# EAGLE design minion_v0.3_rev1 (EAGLE 9.6.2)

## Sheet 1 of 6
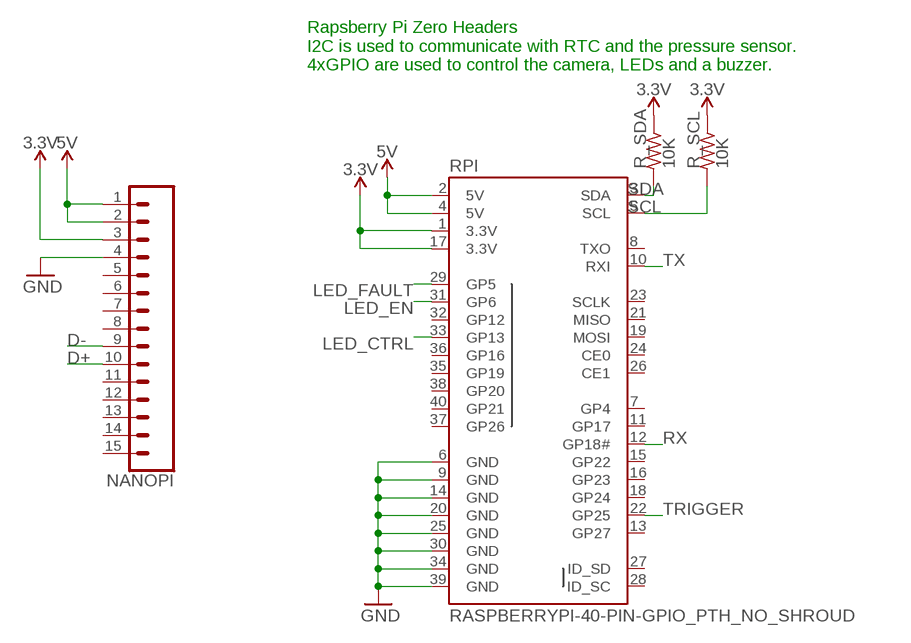
[diagram p0: schematic, sheet 1]

### Parts
NANOPI  CONN_15  [1X15]
R_SCL  10K  RC0603JR-070RL  [RES_0603]
R_SDA  10K  RC0603JR-070RL  [RES_0603]
RPI  RASPBERRYPI-40-PIN-GPIO_PTH_NO_SHROUD  [2X20]

### Nets
3.3V: NANOPI.3 R_SCL.1 R_SDA.1 RPI.1(3.3V) RPI.17(3.3V) ; also sheet 4
5V: NANOPI.1 NANOPI.2 RPI.2(5V) RPI.4(5V) ; also sheet 2,3,5,6
D+: NANOPI.10 ; also sheet 5
D-: NANOPI.9 ; also sheet 5
GND: NANOPI.4 RPI.6(GND) RPI.9(GND) RPI.14(GND) RPI.20(GND) RPI.25(GND) RPI.30(GND) RPI.34(GND) RPI.39(GND) ; also sheet 2,3,4,5,6
LED_CTRL: RPI.33(GP13) ; also sheet 3
LED_EN: RPI.31(GP6) ; also sheet 3
LED_FAULT: RPI.29(GP5) ; also sheet 3
RX: RPI.12(GP18#) ; also sheet 6
SCL: R_SCL.2 RPI.5(SCL) ; also sheet 4
SDA: R_SDA.2 RPI.3(SDA) ; also sheet 4
TRIGGER: RPI.22(GP25) ; also sheet 5
TX: RPI.10(RXI) ; also sheet 6
Unconnected: NANOPI.5 NANOPI.6 NANOPI.7 NANOPI.8 NANOPI.11 NANOPI.12 NANOPI.13 NANOPI.14 NANOPI.15 RPI.7(GP4) RPI.8(TXO) RPI.11(GP17) RPI.13(GP27) RPI.15(GP22) RPI.16(GP23) RPI.18(GP24) RPI.19(MOSI) RPI.21(MISO) RPI.23(SCLK) RPI.24(CE0) RPI.26(CE1) RPI.27(ID_SD) RPI.28(ID_SC) RPI.32(GP12) RPI.35(GP19) RPI.36(GP16) RPI.37(GP26) RPI.38(GP20) RPI.40(GP21)

### Notes on the sheet
- Rapsberry Pi Zero Headers
  I2C is used to communicate with RTC and the pressure sensor.
  4xGPIO are used to control the camera, LEDs and a buzzer.

## Sheet 2 of 6: Power to System
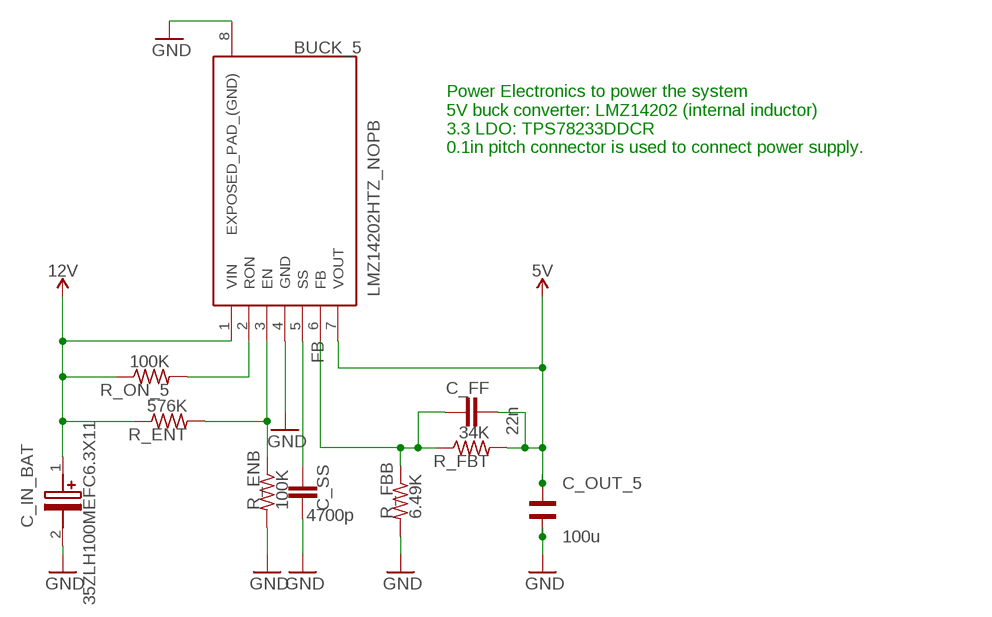
[diagram p1: schematic, sheet 2]

### Parts
BUCK_5  LMZ14202HTZ_NOPB  [NDW0007A]
C_FF  22n  C0603C100C5GACTU  [CAP_0603]
C_IN_BAT  35ZLH100MEFC6.3X11  [CAPPRD250W50D680H1250]
C_OUT_5  100u  WCAP-CSGP_1206_885012008010  [WCAP-CSGP_1206]
C_SS  4700p  C0603C100C5GACTU  [CAP_0603]
R_ENB  100K  RC0603JR-070RL  [RES_0603]
R_ENT  576K  RC0603JR-070RL  [RES_0603]
R_FBB  6.49K  RC0603JR-070RL  [RES_0603]
R_FBT  34K  RC0603JR-070RL  [RES_0603]
R_ON_5  100K  RC0603JR-070RL  [RES_0603]

### Nets
5V: BUCK_5.7(VOUT) C_FF.2 C_OUT_5.2 R_FBT.2 ; also sheet 1,3,5,6
12V: BUCK_5.1(VIN) C_IN_BAT.1(+) R_ENT.1 R_ON_5.1 ; also sheet 6
FB: BUCK_5.6(FB) C_FF.1 R_FBB.1 R_FBT.1
GND: BUCK_5.4(GND) BUCK_5.8(EXPOSED_PAD_(GND)) C_IN_BAT.2(-) C_OUT_5.1 C_SS.2 R_ENB.2 R_FBB.2 ; also sheet 1,3,4,5,6
N$7: BUCK_5.2(RON) R_ON_5.2
N$9: BUCK_5.3(EN) R_ENB.1 R_ENT.2
N$10: BUCK_5.5(SS) C_SS.1

### Notes on the sheet
- Power Electronics to power the system
  5V buck converter: LMZ14202 (internal inductor)
  3.3 LDO: TPS78233DDCR
  0.1in pitch connector is used to connect power supply.

## Sheet 3 of 6: LED Driver
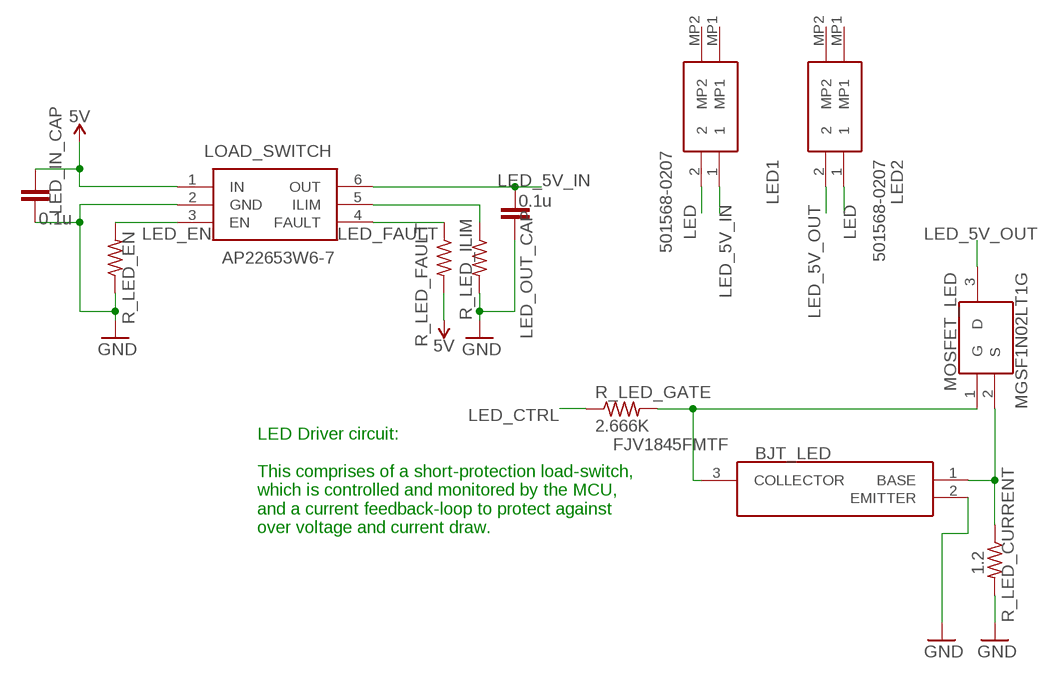
[diagram p2: schematic, sheet 3]

### Parts
BJT_LED  FJV1845FMTF  [SOT95P240X114-3N]
LED1  501568-0207  [5015680207]
LED2  501568-0207  [5015680207]
LED_IN_CAP  0.1u  C0603C100C5GACTU  [CAP_0603]
LED_OUT_CAP  0.1u  C0603C100C5GACTU  [CAP_0603]
LOAD_SWITCH  AP22653W6-7  BCR430UW6-7  [SOT95P285X140-6N]
MOSFET_LED  MGSF1N02LT1G  [SOT96P237X111-3N]
R_LED_CURRENT  1.2  RC0603JR-070RL  [RES_0603]
R_LED_EN  10K  RC0603JR-070RL  [RES_0603]
R_LED_FAULT  10K  RC0603JR-070RL  [RES_0603]
R_LED_GATE  2.666K  RC0603JR-070RL  [RES_0603]
R_LED_ILIM  10K  RC0603JR-070RL  [RES_0603]

### Nets
5V: LED_IN_CAP.1 LOAD_SWITCH.1(IN) R_LED_FAULT.2 ; also sheet 1,2,5,6
GND: BJT_LED.2(EMITTER) LED_IN_CAP.2 LED_OUT_CAP.2 LOAD_SWITCH.2(GND) R_LED_CURRENT.2 R_LED_EN.1 R_LED_ILIM.2 ; also sheet 1,2,4,5,6
LED: LED1.2 LED2.1
LED_5V_IN: LED1.1 LED_OUT_CAP.1 LOAD_SWITCH.6(OUT)
LED_5V_OUT: LED2.2 MOSFET_LED.3(D)
LED_CTRL: R_LED_GATE.1 ; also sheet 1
LED_EN: LOAD_SWITCH.3(EN) R_LED_EN.2 ; also sheet 1
LED_FAULT: LOAD_SWITCH.4(FAULT) R_LED_FAULT.1 ; also sheet 1
N$2: BJT_LED.3(COLLECTOR) MOSFET_LED.1(G) R_LED_GATE.2
N$3: BJT_LED.1(BASE) MOSFET_LED.2(S) R_LED_CURRENT.1
N$5: LOAD_SWITCH.5(ILIM) R_LED_ILIM.1
Unconnected: LED1.MP1 LED1.MP2 LED2.MP1 LED2.MP2

### Notes on the sheet
- LED Driver circuit:
  
  This comprises of a short-protection load-switch, 
  which is controlled and monitored by the MCU, 
  and a current feedback-loop to protect against 
  over voltage and current draw.

## Sheet 4 of 6: Peripherals
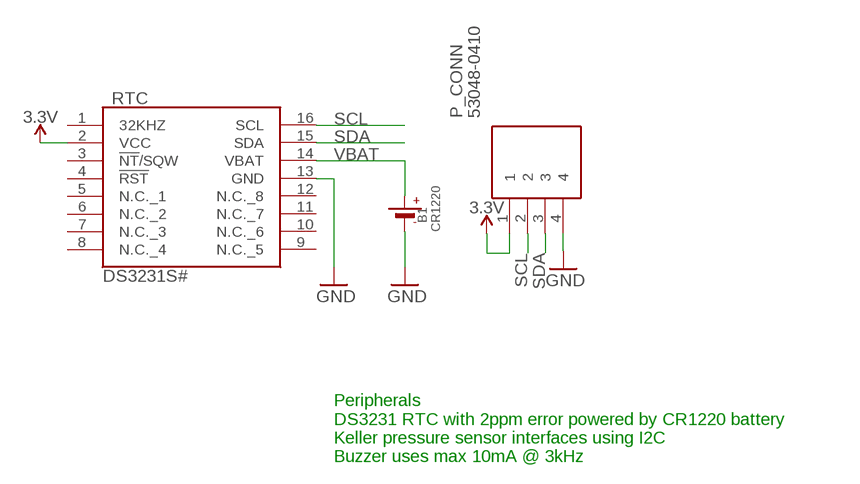
[diagram p3: schematic, sheet 4]

### Parts
B1  CR1220  BATTERYCR1220_SMT  [CR1220]
P_CONN  53048-0410  [SHDR4W35P0X125_1X4_675X550X370]
RTC  DS3231S#  [SOIC127P1032X265-16N]

### Nets
3.3V: P_CONN.1 RTC.2(VCC) ; also sheet 1
GND: B1.- P_CONN.4 RTC.13(GND) ; also sheet 1,2,3,5,6
SCL: P_CONN.2 RTC.16(SCL) ; also sheet 1
SDA: P_CONN.3 RTC.15(SDA) ; also sheet 1
VBAT: B1.+$1(+) RTC.14(VBAT)
Unconnected: RTC.1(32KHZ) RTC.3(!NT!/SQW) RTC.4(!RST) RTC.5(N.C._1) RTC.6(N.C._2) RTC.7(N.C._3) RTC.8(N.C._4) RTC.9(N.C._5) RTC.10(N.C._6) RTC.11(N.C._7) RTC.12(N.C._8)

### Notes on the sheet
- Peripherals
  DS3231 RTC with 2ppm error powered by CR1220 battery
  Keller pressure sensor interfaces using I2C
  Buzzer uses max 10mA @ 3kHz

## Sheet 5 of 6: Camera Trigger
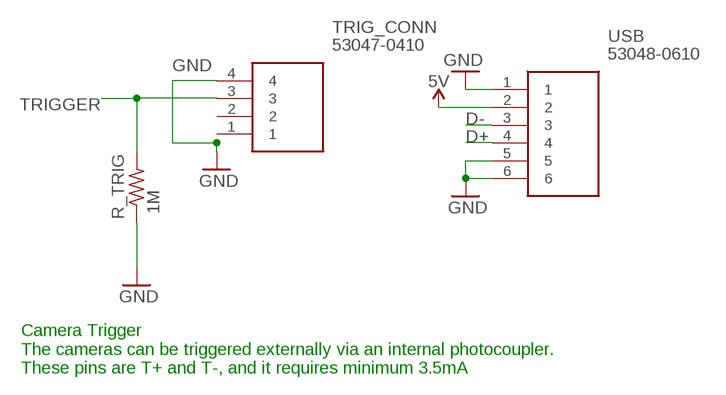
[diagram p4: schematic, sheet 5]

### Parts
R_TRIG  1M  RC0603JR-070RL  [RES_0603]
TRIG_CONN  53047-0410  [53047-0410]
USB  53048-0610  [SHDR6W35P0X125_1X6_925X550X370]

### Nets
5V: USB.2 ; also sheet 1,2,3,6
D+: USB.4 ; also sheet 1
D-: USB.3 ; also sheet 1
GND: R_TRIG.1 TRIG_CONN.1 TRIG_CONN.4 USB.1 USB.5 USB.6 ; also sheet 1,2,3,4,6
TRIGGER: R_TRIG.2 TRIG_CONN.3 ; also sheet 1
Unconnected: TRIG_CONN.2

### Notes on the sheet
- Camera Trigger
  The cameras can be triggered externally via an internal photocoupler. 
  These pins are T+ and T-, and it requires minimum 3.5mA

## Sheet 6 of 6: POWER SRC
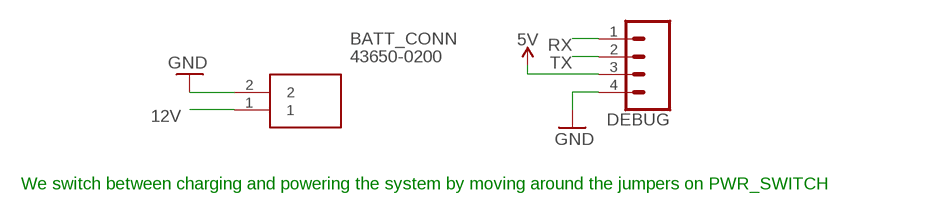
[diagram p5: schematic, sheet 6]

### Parts
BATT_CONN  43650-0200  [43650-0200]
DEBUG  CONN_04  [1X04]

### Nets
5V: DEBUG.3 ; also sheet 1,2,3,5
12V: BATT_CONN.1 ; also sheet 2
GND: BATT_CONN.2 DEBUG.4 ; also sheet 1,2,3,4,5
RX: DEBUG.1 ; also sheet 1
TX: DEBUG.2 ; also sheet 1

### Notes on the sheet
- We switch between charging and powering the system by moving around the jumpers on PWR_SWITCH

## Library data of the parts
B1 = microbuilder:BATTERY: CR1220 SMT - Digikey: 3001K-ND CD2032 BAT-HLD-001 - Digikey: BAT-HLD-001-ND
BATT_CONN = SamacSys_Parts:43650-0200: Header 3.00mm, WTB single row, RA, 2w Molex MICRO-FIT 3.0 Series, Series Number 43650, 3mm Pitch 2 Way 1 Row Shrouded Right Angle PCB Header, Through Hole Source: Datasheet <http://www.molex.com/pdm_docs/sd/436500200_sd.pdf>; DESCRIPTION: Header 3.00mm, WTB single row, RA, 2w Molex MICRO-FIT 3.0 Series, Series Number 43650, 3mm Pitch 2 Way 1 Row Shrouded Right Angle PCB Header, Through Hole; HEIGHT: mm; MANUFACTURER_NAME: Molex; MANUFACTURER_PART_NUMBER: 43650-0200; MOUSER_PART_NUMBER: 538-43650-0200; MOUSER_PRICE-STOCK: https://www.mouser.co.uk/ProductDetail/Molex/43650-0200?qs=HlEFOAM0q6XGaAJJj3Pssw%3D%3D
BJT_LED = SamacSys_Parts:FJV1845FMTF: Bipolar Transistors - BJT NPN Epitaxial Transistor Source: Datasheet <https://componentsearchengine.com/Datasheets/1/FJV1845FMTF.pdf>; DESCRIPTION: Bipolar Transistors - BJT NPN Epitaxial Transistor; HEIGHT: 1.14mm; MANUFACTURER_NAME: ON Semiconductor; MANUFACTURER_PART_NUMBER: FJV1845FMTF; MOUSER_PART_NUMBER: 512-FJV1845FMTF; MOUSER_PRICE-STOCK: https://www.mouser.com/Search/Refine.aspx?Keyword=512-FJV1845FMTF
BUCK_5 = SamacSys_Parts:LMZ14202HTZ_NOPB: SIMPLE SWITCHER® 6V to 42V, 2A High Output Voltage Power Module Source: Datasheet <http://www.ti.com/lit/ds/symlink/lmz14202h.pdf>; DESCRIPTION: SIMPLE SWITCHER&#174; 6V to 42V, 2A High Output Voltage Power Module; HEIGHT: mm; MANUFACTURER_NAME: Texas Instruments; MANUFACTURER_PART_NUMBER: LMZ14202HTZ/NOPB; MOUSER_PART_NUMBER: 926-LMZ14202HTZ/NOPB; MOUSER_PRICE-STOCK: https://www.mouser.com/Search/Refine.aspx?Keyword=926-LMZ14202HTZ%2FNOPB
C_FF C_SS LED_IN_CAP LED_OUT_CAP = Resistor_Capacitor:C0603C100C5GACTU: CAP CER 10PF 50V C0G/NP0 0603 Manufacturer's datasheet <https://content.kemet.com/datasheets/KEM_C1003_C0G_SMD.pdf>; CREATED_BY: PCBLayout.com; DIGIKEY_PART_NUMBER: 399-7814-2-ND; MANUFACTURER: KEMET; MPN: C0603C100C5GACTU; PACKAGE: SMD 0603
C_IN_BAT = SamacSys_Parts:35ZLH100MEFC6.3X11: RUBYCON - 35ZLH100MEFC6.3X11 - CAP, ALU ELEC, 100UF, 35V, RAD Source: Datasheet <https://componentsearchengine.com/Datasheets/1/35ZLH100MEFC6.3X11.pdf>; DESCRIPTION: RUBYCON - 35ZLH100MEFC6.3X11 - CAP, ALU ELEC, 100UF, 35V, RAD; HEIGHT: 12.5mm; MANUFACTURER_NAME: Rubycon; MANUFACTURER_PART_NUMBER: 35ZLH100MEFC6.3X11; MOUSER_PART_NUMBER: 232-35ZLH100MEFC63X1; MOUSER_PRICE-STOCK: https://www.mouser.com/Search/Refine.aspx?Keyword=232-35ZLH100MEFC63X1
C_OUT_5 = Wurth_Elektronik_Passive_Capacitors_rev18b:WCAP-CSGP_1206: WCAP-CSGP Ceramic Capacitors Characteristics Multilayer Ceramic Chip Capacitor Recommended soldering:Reflow, for 0603 and 0805 wave soldering is also allowed Operating temperature:-55 °C to +125 °C; Ceramic characteristics: Class I - NPO ; Class II -X7R, X5R High performance ceramic High capacitance stability Minimal aging Termination:Cu/Ni/Sn <http://katalog.we-online.de/media/images/eisos/WCAP-CSGP_pf2.jpg> Details see: http://katalog.we-online.de/en/pbs/WCAP-CSGP-1206? Created: 2015-01-28 2015 (C) Wurth Elektronik
DEBUG = SparkFun-Connectors:CONN_04: Multi connection point. Often used as Generic Header-pin footprint for 0.1 inch spaced/style header connections On any of the 0.1 inch spaced packages, you can populate with these: Break Away Headers - Straight <https://www.sparkfun.com/products/116> (PRT-00116) Break Away Male Headers - Right Angle <https://www.sparkfun.com/products/553> (PRT-00553) Female Headers <https://www.sparkfun.com/products/115> (PRT-00115) Break Away Headers - Machine Pin <https://www.sparkfun.com/products/117> (PRT-00117) Break Away Female Headers - Swiss Machine Pin <https://www.sparkfun.com/products/743> (PRT-00743) For SCREWTERMINALS and SPRING TERMINALS visit here: Screw Terimnals on SparkFun.com <https://www.sparkfun.com/search/results?term=Screw+Terminals> (5mm/3.5mm/2.54mm spacing) This device is also useful as a general connection point to wire up your design to another part of your project. Our various solder wires solder well into these plated through hole pads. Hook-Up Wire - Assortment (Stranded, 22 AWG) <https://www.sparkfun.com/products/11375> (PRT-11375) Hook-Up Wire - Assortment (Solid Core, 22 AWG) <https://www.sparkfun.com/products/11367> (PRT-11367) View the entire wire category on our website here <https://www.sparkfun.com/categories/141> Special notes: Molex polarized connector foot print use with SKU : PRT-08231 with associated crimp pins and housings. 1MM SMD Version SKU: PRT-10208; PROD_ID: CONN-09696
LED1 LED2 = SamacSys_Parts:501568-0207: Molex PICO-CLASP Series, Series Number 501568, 1mm Pitch 2 Way 2 Row Right Angle PCB Header, Solder Termination, 1A Source: Datasheet <https://www.molex.com/pdm_docs/sd/5015680207_sd.pdf>; DESCRIPTION: Molex PICO-CLASP Series, Series Number 501568, 1mm Pitch 2 Way 2 Row Right Angle PCB Header, Solder Termination, 1A; HEIGHT: 3.4mm; MANUFACTURER_NAME: Molex; MANUFACTURER_PART_NUMBER: 501568-0207; MOUSER_PART_NUMBER: 538-501568-0207; MOUSER_PRICE-STOCK: https://www.mouser.co.uk/ProductDetail/Molex/501568-0207?qs=uEWtSLL707WbFjnit2JOEg%3D%3D
LOAD_SWITCH = SamacSys_Parts:BCR430UW6-7: TRANSISTOR LED DRIVER SOT26 Source: Datasheet <https://www.diodes.com/assets/Datasheets/BCR430UW6.pdf>; DESCRIPTION: Load Switch; HEIGHT: 1.4mm; MANUFACTURER_NAME: Diodes Inc.; MANUFACTURER_PART_NUMBER: AP22653; MOUSER_PART_NUMBER: 621-AP22653W6-7; MOUSER_PRICE-STOCK: https://www.mouser.com/ProductDetail/Diodes-Incorporated/AP22653W6-7?qs=rkhjVJ6%2F3ELFrpB7eThLLg%3D%3D
MOSFET_LED = SamacSys_Parts:MGSF1N02LT1G: Source: Datasheet <https://componentsearchengine.com/Datasheets/1/MGSF1N02LT1G.pdf>; HEIGHT: 1.11mm; MANUFACTURER_NAME: ON Semiconductor; MANUFACTURER_PART_NUMBER: MGSF1N02LT1G; MOUSER_PART_NUMBER: 863-MGSF1N02LT1G; MOUSER_PRICE-STOCK: https://www.mouser.com/Search/Refine.aspx?Keyword=863-MGSF1N02LT1G
NANOPI = SparkFun-Connectors:CONN_15: Multi connection point. Often used as Generic Header-pin footprint for 0.1 inch spaced/style header connections On any of the 0.1 inch spaced packages, you can populate with these: Break Away Headers - Straight <https://www.sparkfun.com/products/116> (PRT-00116) Break Away Male Headers - Right Angle <https://www.sparkfun.com/products/553> (PRT-00553) Female Headers <https://www.sparkfun.com/products/115> (PRT-00115) Break Away Headers - Machine Pin <https://www.sparkfun.com/products/117> (PRT-00117) Break Away Female Headers - Swiss Machine Pin <https://www.sparkfun.com/products/743> (PRT-00743) For SCREWTERMINALS and SPRING TERMINALS visit here: Screw Terimnals on SparkFun.com <https://www.sparkfun.com/search/results?term=Screw+Terminals> (5mm/3.5mm/2.54mm spacing) This device is also useful as a general connection point to wire up your design to another part of your project. Our various solder wires solder well into these plated through hole pads. Hook-Up Wire - Assortment (Stranded, 22 AWG) <https://www.sparkfun.com/products/11375> (PRT-11375) Hook-Up Wire - Assortment (Solid Core, 22 AWG) <https://www.sparkfun.com/products/11367> (PRT-11367) View the entire wire category on our website here <https://www.sparkfun.com/categories/141> Special notes: Molex polarized connector foot print use with SKU : PRT-08231 with associated crimp pins and housings. 1MM SMD Version SKU: PRT-10208 NOTES ON THE VARIANTS LOCK and LOCK_LONGPADS... This footprint was designed to help hold the alignment of a through-hole component (i.e. 6-pin header) while soldering it into place. You may notice that each hole has been shifted either up or down by 0.005 of an inch from it's more standard position (which is a perfectly straight line). This slight alteration caused the pins (the squares in the middle) to touch the edges of the holes. Because they are alternating, it causes a "brace" to hold the component in place. 0.005 has proven to be the perfect amount of "off-center" position when using our standard breakaway headers. Although looks a little odd when you look at the bare footprint, once you have a header in there, the alteration is very hard to notice. Also,if you push a header all the way into place, it is covered up entirely on the bottom side.
P_CONN = SamacSys_Parts:53048-0410: 4 way through board PCB 90deg header Molex PICOBLADE Series, Series Number 53048, 1.25mm Pitch 4 Way 1 Row Right Angle PCB Header, Solder Termination, 1A Source: Datasheet <https://componentsearchengine.com/Datasheets/1/53048-0410.pdf>; DESCRIPTION: 4 way through board PCB 90deg header Molex PICOBLADE Series, Series Number 53048, 1.25mm Pitch 4 Way 1 Row Right Angle PCB Header, Solder Termination, 1A; HEIGHT: 3.7mm; MANUFACTURER_NAME: Molex; MANUFACTURER_PART_NUMBER: 53048-0410; MOUSER_PART_NUMBER: 538-53048-0410; MOUSER_PRICE-STOCK: https://www.mouser.com/Search/Refine.aspx?Keyword=538-53048-0410
R_ENB R_ENT R_FBB R_FBT R_LED_CURRENT R_LED_EN R_LED_FAULT R_LED_GATE R_LED_ILIM R_ON_5 R_SCL R_SDA R_TRIG = Resistor_Capacitor:RC0603JR-070RL: RES SMD 0 OHM JUMPER 1/10W 0603 Manufacturer's datasheet <http://www.yageo.com/documents/recent/PYu-RC_Group_51_RoHS_L_10.pdf>; CREATED_BY: PCBLayout.com; DIGIKEY_PART_NUMBER: 311-0.0GRTR-ND; MANUFACTURER: Yageo; MPN: RC0603JR-070RL; PACKAGE: SMD 0603
RPI = SparkFun-Connectors:RASPBERRYPI-40-PIN-GPIO: Raspberry Pi GPIO Header 2x20 pin connector, as found on B, B+, A+ models. Both shrouded PTH and SMT versions available. SparkFun Products: GPIO Shrouded Header <https://www.sparkfun.com/products/13054>- PTH SparkFun Pi Wedge (Preassembled) <https://www.sparkfun.com/products/13717>
RTC = SamacSys_Parts:DS3231S#: Real Time Clock Serial Maxim DS3231S#, Real Time Clock Serial-I2C, 16-Pin SOIC Source: Datasheet <https://componentsearchengine.com/Datasheets/1/DS3231S#.pdf>; DESCRIPTION: Real Time Clock Serial Maxim DS3231S#, Real Time Clock Serial-I2C, 16-Pin SOIC; HEIGHT: 2.65mm; MANUFACTURER_NAME: Maxim Integrated; MANUFACTURER_PART_NUMBER: DS3231S#; MOUSER_PART_NUMBER: 700-DS3231S#; MOUSER_PRICE-STOCK: https://www.mouser.com/Search/Refine.aspx?Keyword=700-DS3231S%23
TRIG_CONN = SamacSys_Parts:53047-0410: 4 way through board PCB straight header Molex PICOBLADE Series, Series Number 53047, 1.25mm Pitch 4 Way 1 Row Straight PCB Header, Solder Termination, 1A Source: Datasheet; DESCRIPTION: 4 way through board PCB straight header Molex PICOBLADE Series, Series Number 53047, 1.25mm Pitch 4 Way 1 Row Straight PCB Header, Solder Termination, 1A; HEIGHT: mm; MANUFACTURER_NAME: Molex; MANUFACTURER_PART_NUMBER: 53047-0410; MOUSER_PART_NUMBER: 538-53047-0410; MOUSER_PRICE-STOCK: https://www.mouser.co.uk/ProductDetail/Molex/53047-0410?qs=DcEdecHHM4i8IPBxVAuJtg%3D%3D
USB = SamacSys_Parts:53048-0610: 6way r/a through board PCB header,125Vac Molex PICOBLADE Series, Series Number 53048, 1.25mm Pitch 6 Way 1 Row Right Angle PCB Header, Solder Termination, 1A Source: Datasheet <https://www.molex.com/pdm_docs/sd/530481010_sd.pdf>; DESCRIPTION: 6way r/a through board PCB header,125Vac Molex PICOBLADE Series, Series Number 53048, 1.25mm Pitch 6 Way 1 Row Right Angle PCB Header, Solder Termination, 1A; HEIGHT: 3.7mm; MANUFACTURER_NAME: Molex; MANUFACTURER_PART_NUMBER: 53048-0610; MOUSER_PART_NUMBER: 538-53048-0610; MOUSER_PRICE-STOCK: https://www.mouser.co.uk/ProductDetail/Molex/53048-0610?qs=4XSMV6Twtb0hBXTOEHM3BQ%3D%3D

## Board
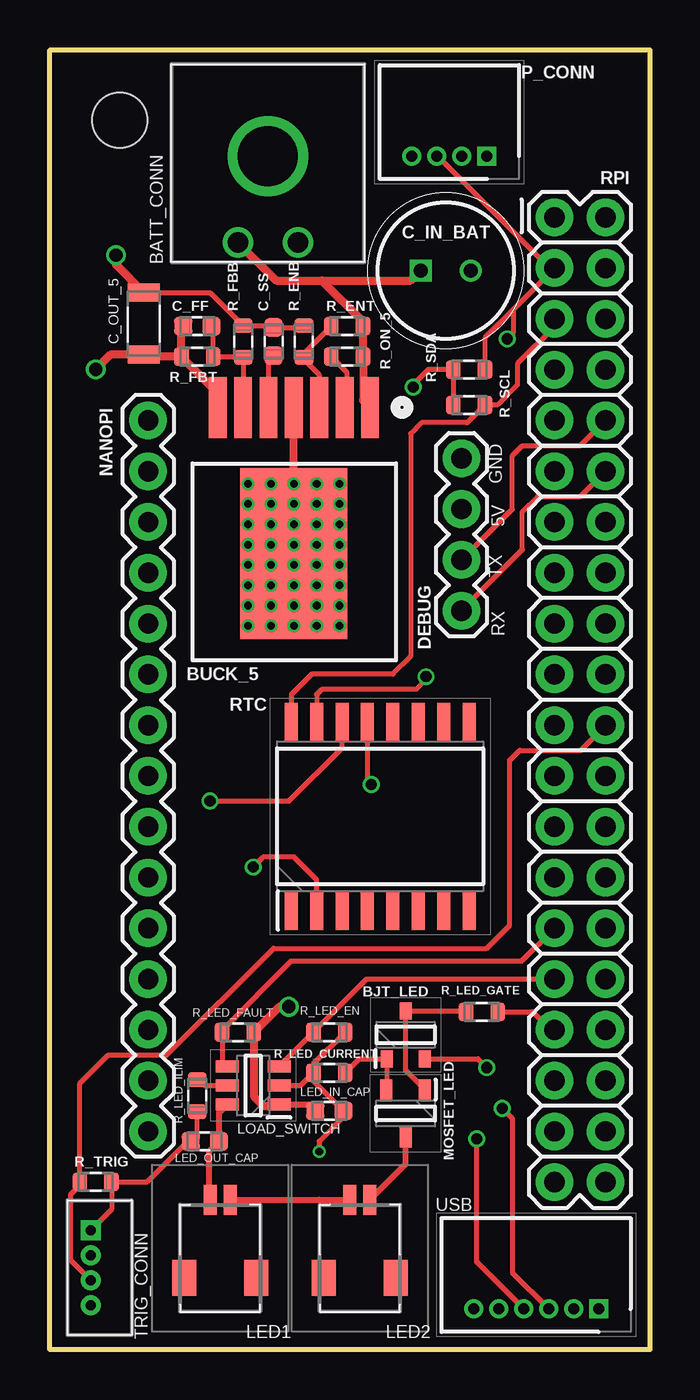
[diagram p6: board, top side]
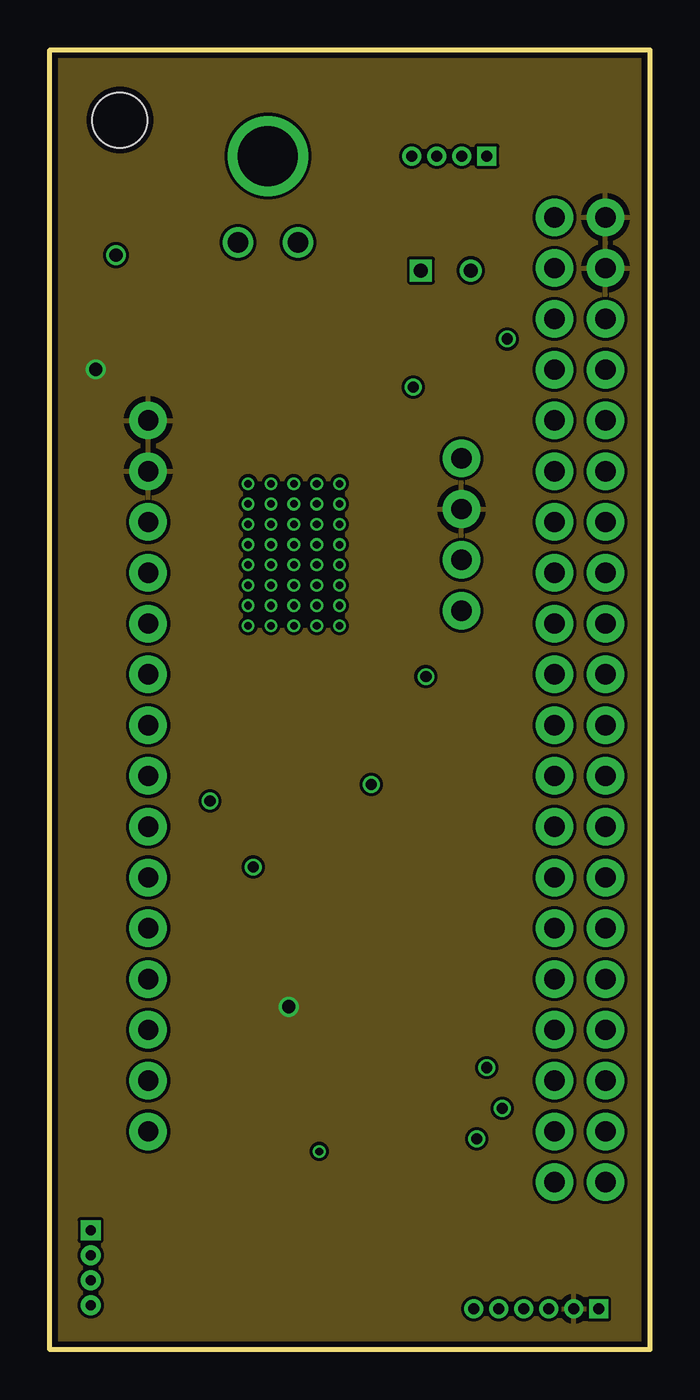
[diagram p7: board, inner layer 5V]
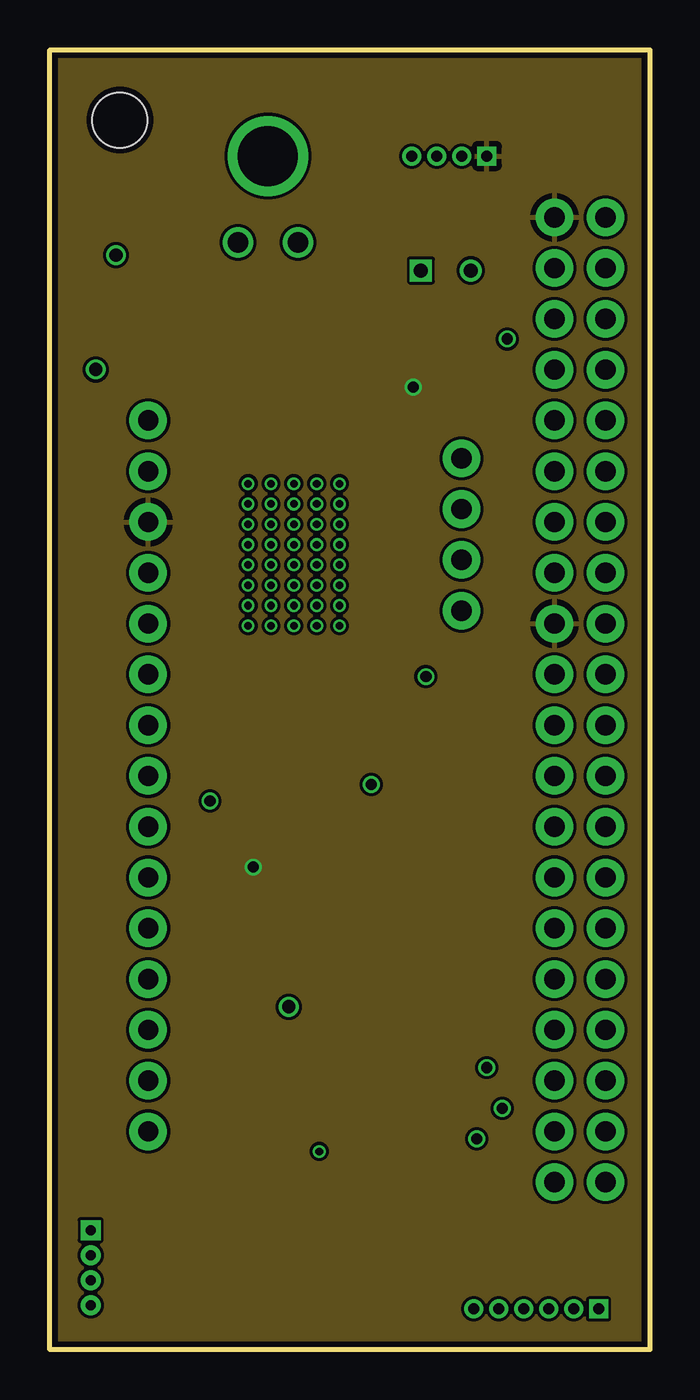
[diagram p8: board, inner layer 3V]
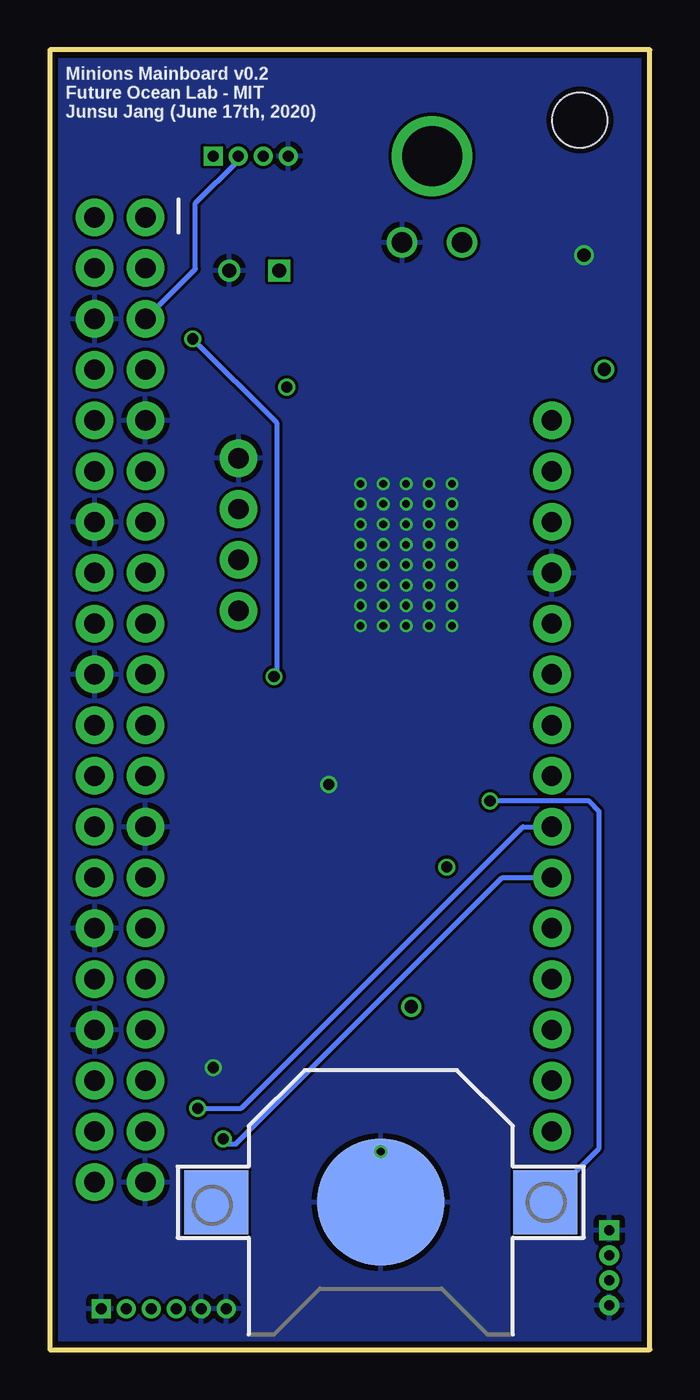
[diagram p9: board, bottom side, seen from below]

Size 30 x 65 mm. Coordinates in mm from the lower left corner, seen from the top.
Outline: 0,0 0,65 30,65 30,0 0,0
Copper layers (1+2*15+16): Top 0.0356mm / dielectric 0.2489mm / 5V 0.0356mm / dielectric 39mil / 3V 0.0356mm / dielectric 0.2489mm / Bottom 0.0356mm
Design rules "advanced_circuits_4layer *": minimum track width 6mil, minimum drill 15mil, track to track 6mil, track to pad 6mil, pad to pad 6mil, via to via 6mil, smd to smd 6mil, copper to edge 11mil, drill to drill 6mil, minimum pad ring 7mil, minimum via ring 5mil, stop-mask expansion 4mil, vias tented up to drill 0mil, thermal gap 11mil
Holes 2.75 mm at 3.5,61.5

### Footprints (pad centres in the part's own frame; a part is rotated, then mirrored left to right if it is on the bottom)
CR1220 = smd 3.2 x 3.2: +$1 -8.225,0; +$2 8.225,0 | smd 6.35 x 6.35: - 0,0
43650-0200 = drill 1.02 pad 1.52: 1 0,0; 2 -3,0 | drill 3 pad 3: 3 -1.5,-4.32
SOT95P240X114-3N = smd 0.85 x 0.6: 1 -1.2,0.95; 2 -1.2,-0.95; 3 1.2,0
NDW0007A = smd 0.89 x 3.06: 1 -3.81,0; 2 -2.54,0; 3 -1.27,0; 4 0,0; 5 1.27,0; 6 2.54,0; 7 3.81,0 | smd 5.35 x 8.54: 8 0,7.305
CAP_0603 = smd 0.92 x 0.93: 1 -0.705,0; 2 0.705,0
CAPPRD250W50D680H1250 = drill 0.7 pad 1.1 square: 1 0,0 | drill 0.7 pad 1.1: 2 2.5,0
WCAP-CSGP_1206 = smd 0.9 x 1.6: 1 -1.55,0; 2 1.55,0
1X04 = drill 1.016 pad 1.88: 1 0,0; 2 2.54,0; 3 5.08,0; 4 7.62,0
5015680207 = smd 0.65 x 1.5: 1 -0.5,2.8; 2 0.5,2.8 | smd 1.2 x 1.8: MP1 -1.8,-1.1; MP2 1.8,-1.1
SOT95P285X140-6N = smd 1.15 x 0.6: 1 -1.3,0.95; 2 -1.3,0; 3 -1.3,-0.95; 4 1.3,-0.95; 5 1.3,0; 6 1.3,0.95
SOT96P237X111-3N = smd 1 x 0.6: 1 -1.2,0.955; 2 -1.2,-0.955; 3 1.2,0
1X15 = drill 1.016 pad 1.88: 1 0,0; 2 2.54,0; 3 5.08,0; 4 7.62,0; 5 10.16,0; 6 12.7,0; 7 15.24,0; 8 17.78,0; 9 20.32,0; 10 22.86,0; 11 25.4,0; 12 27.94,0; 13 30.48,0; 14 33.02,0; 15 35.56,0
SHDR4W35P0X125_1X4_675X550X370 = drill 0.55 pad 0.95 square: 1 0,0 | drill 0.55 pad 0.95: 2 -1.25,0; 3 -2.5,0; 4 -3.75,0
RES_0603 = smd 0.74 x 0.93: 1 -0.795,0; 2 0.795,0
2X20 = drill 1.016 pad 1.88: 1 0,0; 2 0,2.54; 3 2.54,0; 4 2.54,2.54; 5 5.08,0; 6 5.08,2.54; 7 7.62,0; 8 7.62,2.54; 9 10.16,0; 10 10.16,2.54; 11 12.7,0; 12 12.7,2.54; 13 15.24,0; 14 15.24,2.54; 15 17.78,0; 16 17.78,2.54; 17 20.32,0; 18 20.32,2.54; 19 22.86,0; 20 22.86,2.54; 21 25.4,0; 22 25.4,2.54; 23 27.94,0; 24 27.94,2.54; 25 30.48,0; 26 30.48,2.54; 27 33.02,0; 28 33.02,2.54; 29 35.56,0; 30 35.56,2.54; 31 38.1,0; 32 38.1,2.54; 33 40.64,0; 34 40.64,2.54; 35 43.18,0; 36 43.18,2.54; 37 45.72,0; 38 45.72,2.54; 39 48.26,0; 40 48.26,2.54
SOIC127P1032X265-16N = smd 1.925 x 0.65: 1 -4.712,4.445; 2 -4.712,3.175; 3 -4.712,1.905; 4 -4.712,0.635; 5 -4.712,-0.635; 6 -4.712,-1.905; 7 -4.712,-3.175; 8 -4.712,-4.445; 9 4.712,-4.445; 10 4.712,-3.175; 11 4.712,-1.905; 12 4.712,-0.635; 13 4.712,0.635; 14 4.712,1.905; 15 4.712,3.175; 16 4.712,4.445
53047-0410 = drill 0.5 pad 1 square: 1 0,0 | drill 0.5 pad 1: 2 -1.25,0; 3 -2.5,0; 4 -3.75,0
SHDR6W35P0X125_1X6_925X550X370 = drill 0.55 pad 0.95 square: 1 0,0 | drill 0.55 pad 0.95: 2 -1.25,0; 3 -2.5,0; 4 -3.75,0; 5 -5,0; 6 -6.25,0

### Placement (x,y rotation side)
B1  13.46,7.37 180 bottom
BATT_CONN  9.4,55.37 180 top
BJT_LED  17.78,15.75 90 top
BUCK_5  12.19,47.12 180 top
C_FF  7.37,51.18 180 top
C_IN_BAT  18.54,53.98 0 top
C_OUT_5  4.7,51.31 270 top
C_SS  11.18,50.42 90 top
DEBUG  20.57,36.96 90 top
LED1  8.51,4.7 0 top
LED2  15.49,4.7 0 top
LED_IN_CAP  13.97,11.94 0 top
LED_OUT_CAP  7.75,10.41 180 top
LOAD_SWITCH  10.16,13.21 180 top
MOSFET_LED  17.78,11.81 270 top
NANOPI  4.91,46.47 270 top
P_CONN  21.84,59.69 0 top
R_ENB  12.7,50.42 90 top
R_ENT  14.86,51.18 180 top
R_FBB  9.65,50.42 90 top
R_FBT  7.37,49.66 180 top
R_LED_CURRENT  13.97,13.84 180 top
R_LED_EN  13.97,15.88 180 top
R_LED_FAULT  9.4,15.88 0 top
R_LED_GATE  21.59,16.89 180 top
R_LED_ILIM  7.37,12.7 270 top
R_ON_5  14.86,49.66 180 top
R_SCL  20.95,47.24 0 top
R_SDA  20.95,49.02 0 top
R_TRIG  2.29,8.38 180 top
RPI  25.23,56.63 270 top
RTC  16.51,26.67 90 top
TRIG_CONN  2.03,5.97 90 top
USB  27.43,2.03 0 top

### Tracks (layer width: path | path; a pad name or v marks a point on that pad's centre or on a via)
3.3V  (via drill 0.56)
  Top 0.254: RTC.2 13.34,23.5 12.19,24.64 10.67,24.64 v10.16,24.13 | R_SCL.1 R_SDA.1 18.92,49.02 18.16,48.26 v18.16,48.13
  pour 3V: 0.13,65.15 0.25,65.02 29.97,65.02 29.97,0 0,0 0,65.02
5V  (via drill 0.66)
  Top 0.305: LOAD_SWITCH.1 12.95,12.26 LED_IN_CAP.1
  Top 0.406: BUCK_5.7 8.38,47.85 R_FBT.2 | R_FBT.2 4.8,49.66 C_OUT_5.2 3.02,49.76 v2.29,49.02 | LOAD_SWITCH.1 11.39,12.19 10.67,12.19 10.19,12.67 R_LED_FAULT.2 11.46,17.14 v11.94,17.14 | R_FBT.2 6.57,51.09 C_FF.2
  pour 5V: 0,65.02 29.97,65.02 29.97,0 0,0
12V
  Top 0.406: BATT_CONN.1 11.3,53.47 13.59,53.47 | C_IN_BAT.1 18.03,53.47 13.59,53.47 | 13.59,53.47 15.65,51.4 R_ENT.1 R_ON_5.1 15.65,47.47 BUCK_5.1
D+  (via drill 0.56)
  Top 0.254: USB.4 21.34,4.38 v21.34,10.54
  Bottom 0.254: v21.34,10.54 21.08,10.29 20.7,10.29 7.38,23.61 NANOPI.10
D-  (via drill 0.56)
  Top 0.254: USB.3 23.11,3.85 23.11,11.56 v22.61,12.06
  Bottom 0.254: v22.61,12.06 20.45,12.06 6.36,26.15 NANOPI.9
FB
  Top 0.254: C_FF.1 8.16,51.09 R_FBT.1 9.62,49.66 R_FBB.1 BUCK_5.6
GND  (via drill 0.38, 0.56, 0.66)
  Top 0.254: R_ENB.2 12.61,51.12 C_SS.2 11.09,51.21 R_FBB.2 8.01,52.86 C_OUT_5.1 | R_LED_ILIM.2 7.37,10.74 LED_OUT_CAP.2 6.89,10.41 4.86,8.38 R_TRIG.1 3.08,7.02 TRIG_CONN.1 | R_LED_CURRENT.2 13.18,13.44 LED_IN_CAP.2 14.68,11.63 13.46,10.41 v13.46,9.91 | LOAD_SWITCH.2 12.54,13.21 R_LED_CURRENT.2 | R_LED_CURRENT.2 13.18,14.29 R_LED_EN.1 | BJT_LED.2 21.39,14.55 v21.84,14.1 | RTC.13 15.88,28.32 16,28.19 v16.07,28.26
  Top 0.406: C_OUT_5.1 3.3,54.26 v3.3,54.74 | v12.19,43.31 BUCK_5.8 BUCK_5.4
  Bottom 0.254: B1.- v13.46,9.91
  other vias: 9.91,43.31 11.05,43.31 13.34,43.31 14.48,43.31 9.91,42.29 11.05,42.29 12.19,42.29 13.34,42.29 14.48,42.29 9.91,41.27 11.05,41.27 12.19,41.27 13.34,41.27 14.48,41.27 9.91,40.26 11.05,40.26 12.19,40.26 13.34,40.26 14.48,40.26 9.91,39.24 11.05,39.24 12.19,39.24 13.34,39.24 14.48,39.24 9.91,38.23 11.05,38.23 12.19,38.23 13.34,36.2 14.48,36.2 9.91,37.21 11.05,37.21 12.19,37.21 13.34,38.23 14.48,38.23 9.91,36.2 11.05,36.2 12.19,36.2 13.34,37.21 14.48,37.21
  pour Bottom: 0,65.02 29.97,65.02 29.97,0 0,0
LED
  Top 0.305: LED1.2 13.46,7.5 LED2.1
LED_5V_IN
  Top 0.305: LED1.1 7.94,7.56 7.94,9.91 LED_OUT_CAP.1 8.45,11.85 LOAD_SWITCH.6
LED_5V_OUT
  Top 0.305: LED2.2 17.78,9.29 MOSFET_LED.3
LED_CTRL
  Top 0.254: R_LED_GATE.1 24.13,16.89 25.13,15.89 RPI.33
LED_EN
  Top 0.254: LOAD_SWITCH.3 R_LED_EN.2 15.83,18.53 RPI.31
LED_FAULT
  Top 0.254: LOAD_SWITCH.4 8.61,14.41 R_LED_FAULT.1 8.6,15.97 12.06,19.43 23.59,19.43 RPI.29
N$2
  Top 0.254: MOSFET_LED.1 17.78,13.97 BJT_LED.3 20.74,16.95 R_LED_GATE.2
N$3
  Top 0.254: R_LED_CURRENT.1 15.47,14.55 BJT_LED.1 MOSFET_LED.2
N$5
  Top 0.254: R_LED_ILIM.1 7.46,13.49 7.75,13.21 LOAD_SWITCH.5
N$7
  Top 0.254: R_ON_5.2 14.83,48.9 14.83,47.21 BUCK_5.2
N$9
  Top 0.254: R_ENT.2 12.7,49.82 R_ENB.1 12.7,49.53 13.46,48.77 BUCK_5.3
N$10
  Top 0.254: C_SS.1 10.92,49.46 BUCK_5.5
RX
  Top 0.254: DEBUG.1 23.62,40.01 23.62,41.91 24.38,42.67 26.51,42.67 RPI.12
SCL
  Top 0.254: RPI.5 25.23,51.17 23.37,49.31 23.37,48.26 22.35,47.24 R_SCL.2 20.86,46.35 18.57,46.35 18.03,45.81 18.03,34.67 17.14,33.78 13.08,33.78 12.06,32.77 12.06,31.51 12.19,31.38 RTC.16
  Bottom 0.254: RPI.5 22.73,54.05 22.73,57.33 20.59,59.47 P_CONN.2
SDA  (via drill 0.56)
  Top 0.254: P_CONN.3 19.38,59.69 24.98,54.09 RPI.3 23.16,52.02 | 23.16,52.02 21.75,50.61 R_SDA.2 | 23.16,52.02 23.16,50.85 v22.86,50.55 | v18.8,33.66 18.8,33.53 18.29,33.02 13.59,33.02 13.34,32.77 RTC.15
  Bottom 0.254: v22.86,50.55 18.67,46.35 18.67,33.78 v18.8,33.66
TRIGGER
  Top 0.254: RPI.22 27.77,31.2 26.54,29.97 23.5,29.97 22.99,29.46 22.99,21.21 21.84,20.07 11.18,20.07 5.84,14.73 2.92,14.73 1.49,13.3 R_TRIG.2 1.49,8.22 1.02,7.75 1.02,4.49 TRIG_CONN.3
TX
  Top 0.254: DEBUG.2 23.11,42.04 23.11,44.7 23.62,45.21 26.51,45.21 RPI.10
VBAT  (via drill 0.56)
  Top 0.254: v8,27.43 11.94,27.43 14.61,30.1 RTC.14
  Bottom 0.254: B1.+$1 2.54,10.06 2.54,26.92 3.05,27.43 v8,27.43

### Text on the board
tNames: GND | 5V | TX | RX
bNames: Minions Mainboard v0.2 / Future Ocean Lab - MIT / Junsu Jang (June 17th, 2020)